# Altium schematic sheet Power.SchDoc
size Letter; SheetNumber: 3; SheetTotal: 4
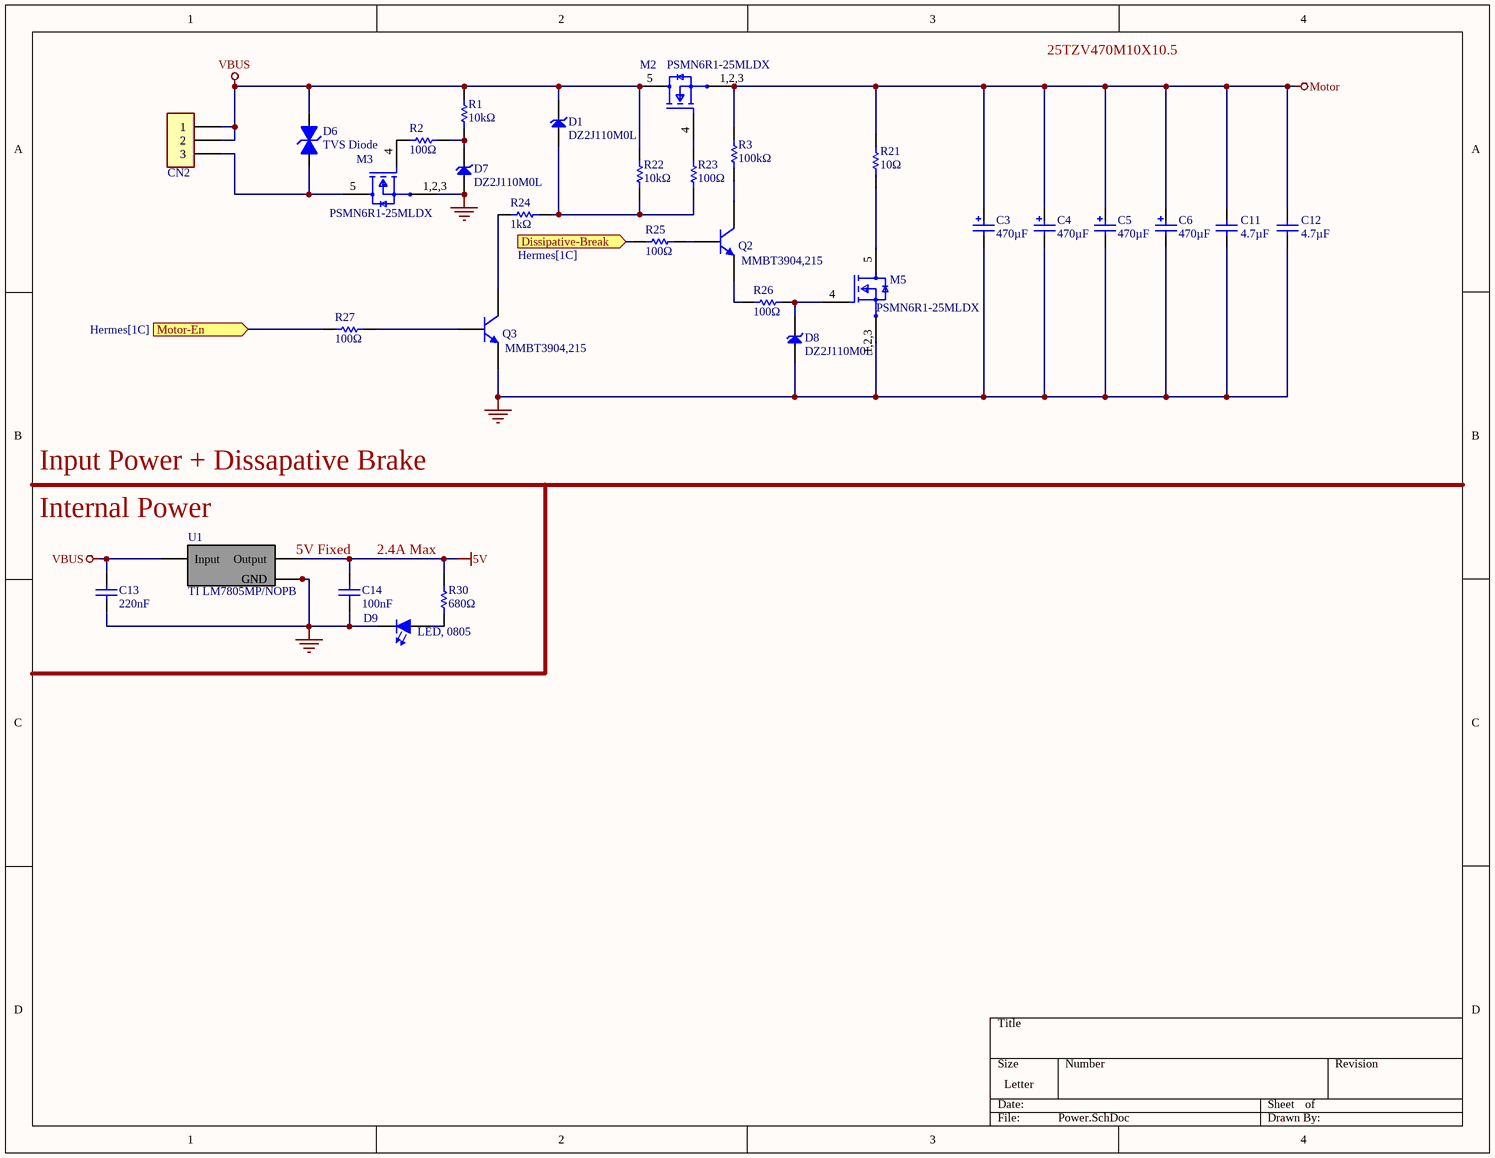
[diagram p0: Power.SchDoc]

## Parts
C3  470µF  [Alum Capacitor]
C4  470µF  [Alum Capacitor]
C5  470µF  [Alum Capacitor]
C6  470µF  [Alum Capacitor]
C11  4.7µF  [Cap, 1206]
C12  4.7µF  [Cap, 1206]
C13  220nF  [Cap, 0805]
C14  100nF  [Cap, 0805]
CN2  Conn, 3-Pin  [Conn, 3-Pin]  (value not drawn)
D1  DZ2J110M0L  [Zener, 11V]
D6  TVS Diode  [TVS Diode]
D7  DZ2J110M0L  [Zener, 11V]
D8  DZ2J110M0L  [Zener, 11V]
D9  LED, 0805  [LED, 0805]
M2  PSMN6R1-25MLDX  [FP-SOT1210-MFG]
M3  PSMN6R1-25MLDX  [FP-SOT1210-MFG]
M5  PSMN6R1-25MLDX  [FP-SOT1210-MFG]
Q2  MMBT3904,215  [SOT-23]
Q3  MMBT3904,215  [SOT-23]
R1  10kΩ  [Res, 0603]
R2  100Ω  [Res, 0603]
R3  100kΩ  [Res, 0603]
R21  10Ω  [Res, 2512]
R22  10kΩ  [Res, 0603]
R23  100Ω  [Res, 0603]
R24  1kΩ  [Res, 0603]
R25  100Ω  [Res, 0603]
R26  100Ω  [Res, 0603]
R27  100Ω  [Res, 0603]
R30  680Ω  [Res, 0603]
U1  TI LM7805MP/NOPB  [LM7805MP/NOPB]

## Ports
Dissipative-Break (in, see Hermes[1C]), Motor-En (in, see Hermes[1C])

## Nets
5V: C14.2(Cathode) R30.2 U1.3(Output)
GND: C3.2 C4.2 C5.2 C6.2 C11.1(Anode) C12.1(Anode) C13.1(Anode) C14.1(Anode) D7.A(Anode) D8.A(Anode) D9.1(Cathode) M3.1,2,3(S) M5.1,2,3(S) Q3.2(E) U1.2(GND) U1.4(GND)
Motor: C3.1 C4.1 C5.1 C6.1 C11.2(Cathode) C12.2(Cathode) M2.1,2,3(S) R3.2 R21.2
VBUS: C13.2(Cathode) CN2.1 CN2.2 D1.K(Cathode) D6.2(Cathode) M2.5(D) R1.2 R22.2 U1.1(Input)
Dissipative-Break: R25.2 ; port Dissipative-Break
Motor-En: R27.2 ; port Motor-En
NetCN2_3: CN2.3 D6.1(Anode) M3.5(D)
NetD1_A: D1.A(Anode) R22.1 R23.2 R24.2
NetD7_K: D7.K(Cathode) R1.1 R2.2
NetD8_K: D8.K(Cathode) M5.4(G) R26.1
NetD9_2: D9.2(Anode) R30.1
NetM2_4: M2.4(G) R23.1
NetM3_4: M3.4(G) R2.1
NetM5_5: M5.5(D) R21.1
NetQ2_1: Q2.1(B) R25.1
NetQ2_2: Q2.2(E) R26.2
NetQ2_3: Q2.3(C) R3.1
NetQ3_1: Q3.1(B) R27.1
NetQ3_3: Q3.3(C) R24.1

## Notes on the sheet
- 25TZV470M10X10.5
- Input Power + Dissapative Brake
- (near U1) Internal Power
- 5V Fixed
- 2.4A Max

## Library data of the parts
C3-C6 = Aluminum Cap
C11 C12 = Cap, 1206
C13 C14 = Cap, 0805
D1 D7 D8 = Zener, 11V
M2 M3 M5 = InverterNmos: PSMN6R1-25MLD/MLFPAK/REEL 7 Q
Q2 Q3 = CMP-052-0017-3: NPN, 40V/200mA, 250mW, SOT-23; Publisher: Andy Bates; PackageReference: TO-92A; Published: 8-Jun-2000; Design Item ID: MMBT3904,215; RoHS Compliant: Yes; Component Type: Standard; LatestRevisionDate: 09-Sep-2016; Source: AUVic_Schematic_Library_Transistors.SchLib; DatasheetVersion: 1997; Pin Count: 3
R1-R3 R22-R27 R30 = Res, 0603
R21 = Res, 2512
U1 = LM7805MP/NOPB: Supplier 1: Digi-Key; Supplier Part Number 1: 497-1572-1-ND
CN2 = Conn, 3-Pin: Supplier 1: Digi-Key; Supplier Part Number 1: A98334-ND
D6 = TVS Diode: Supplier 1: Digi-Key; Supplier Part Number 1: SMBJ24CA-E3/52GICT-ND